# EasyEDA schematic SCH_prosthetic_2026-05-21.json
TITLE: Prosthetic Control Interface Board; REV: 1.0; Date: 2026-05-18; Sheet: 1/1; Drawn By: Tufan Layek; Company: SRMIST
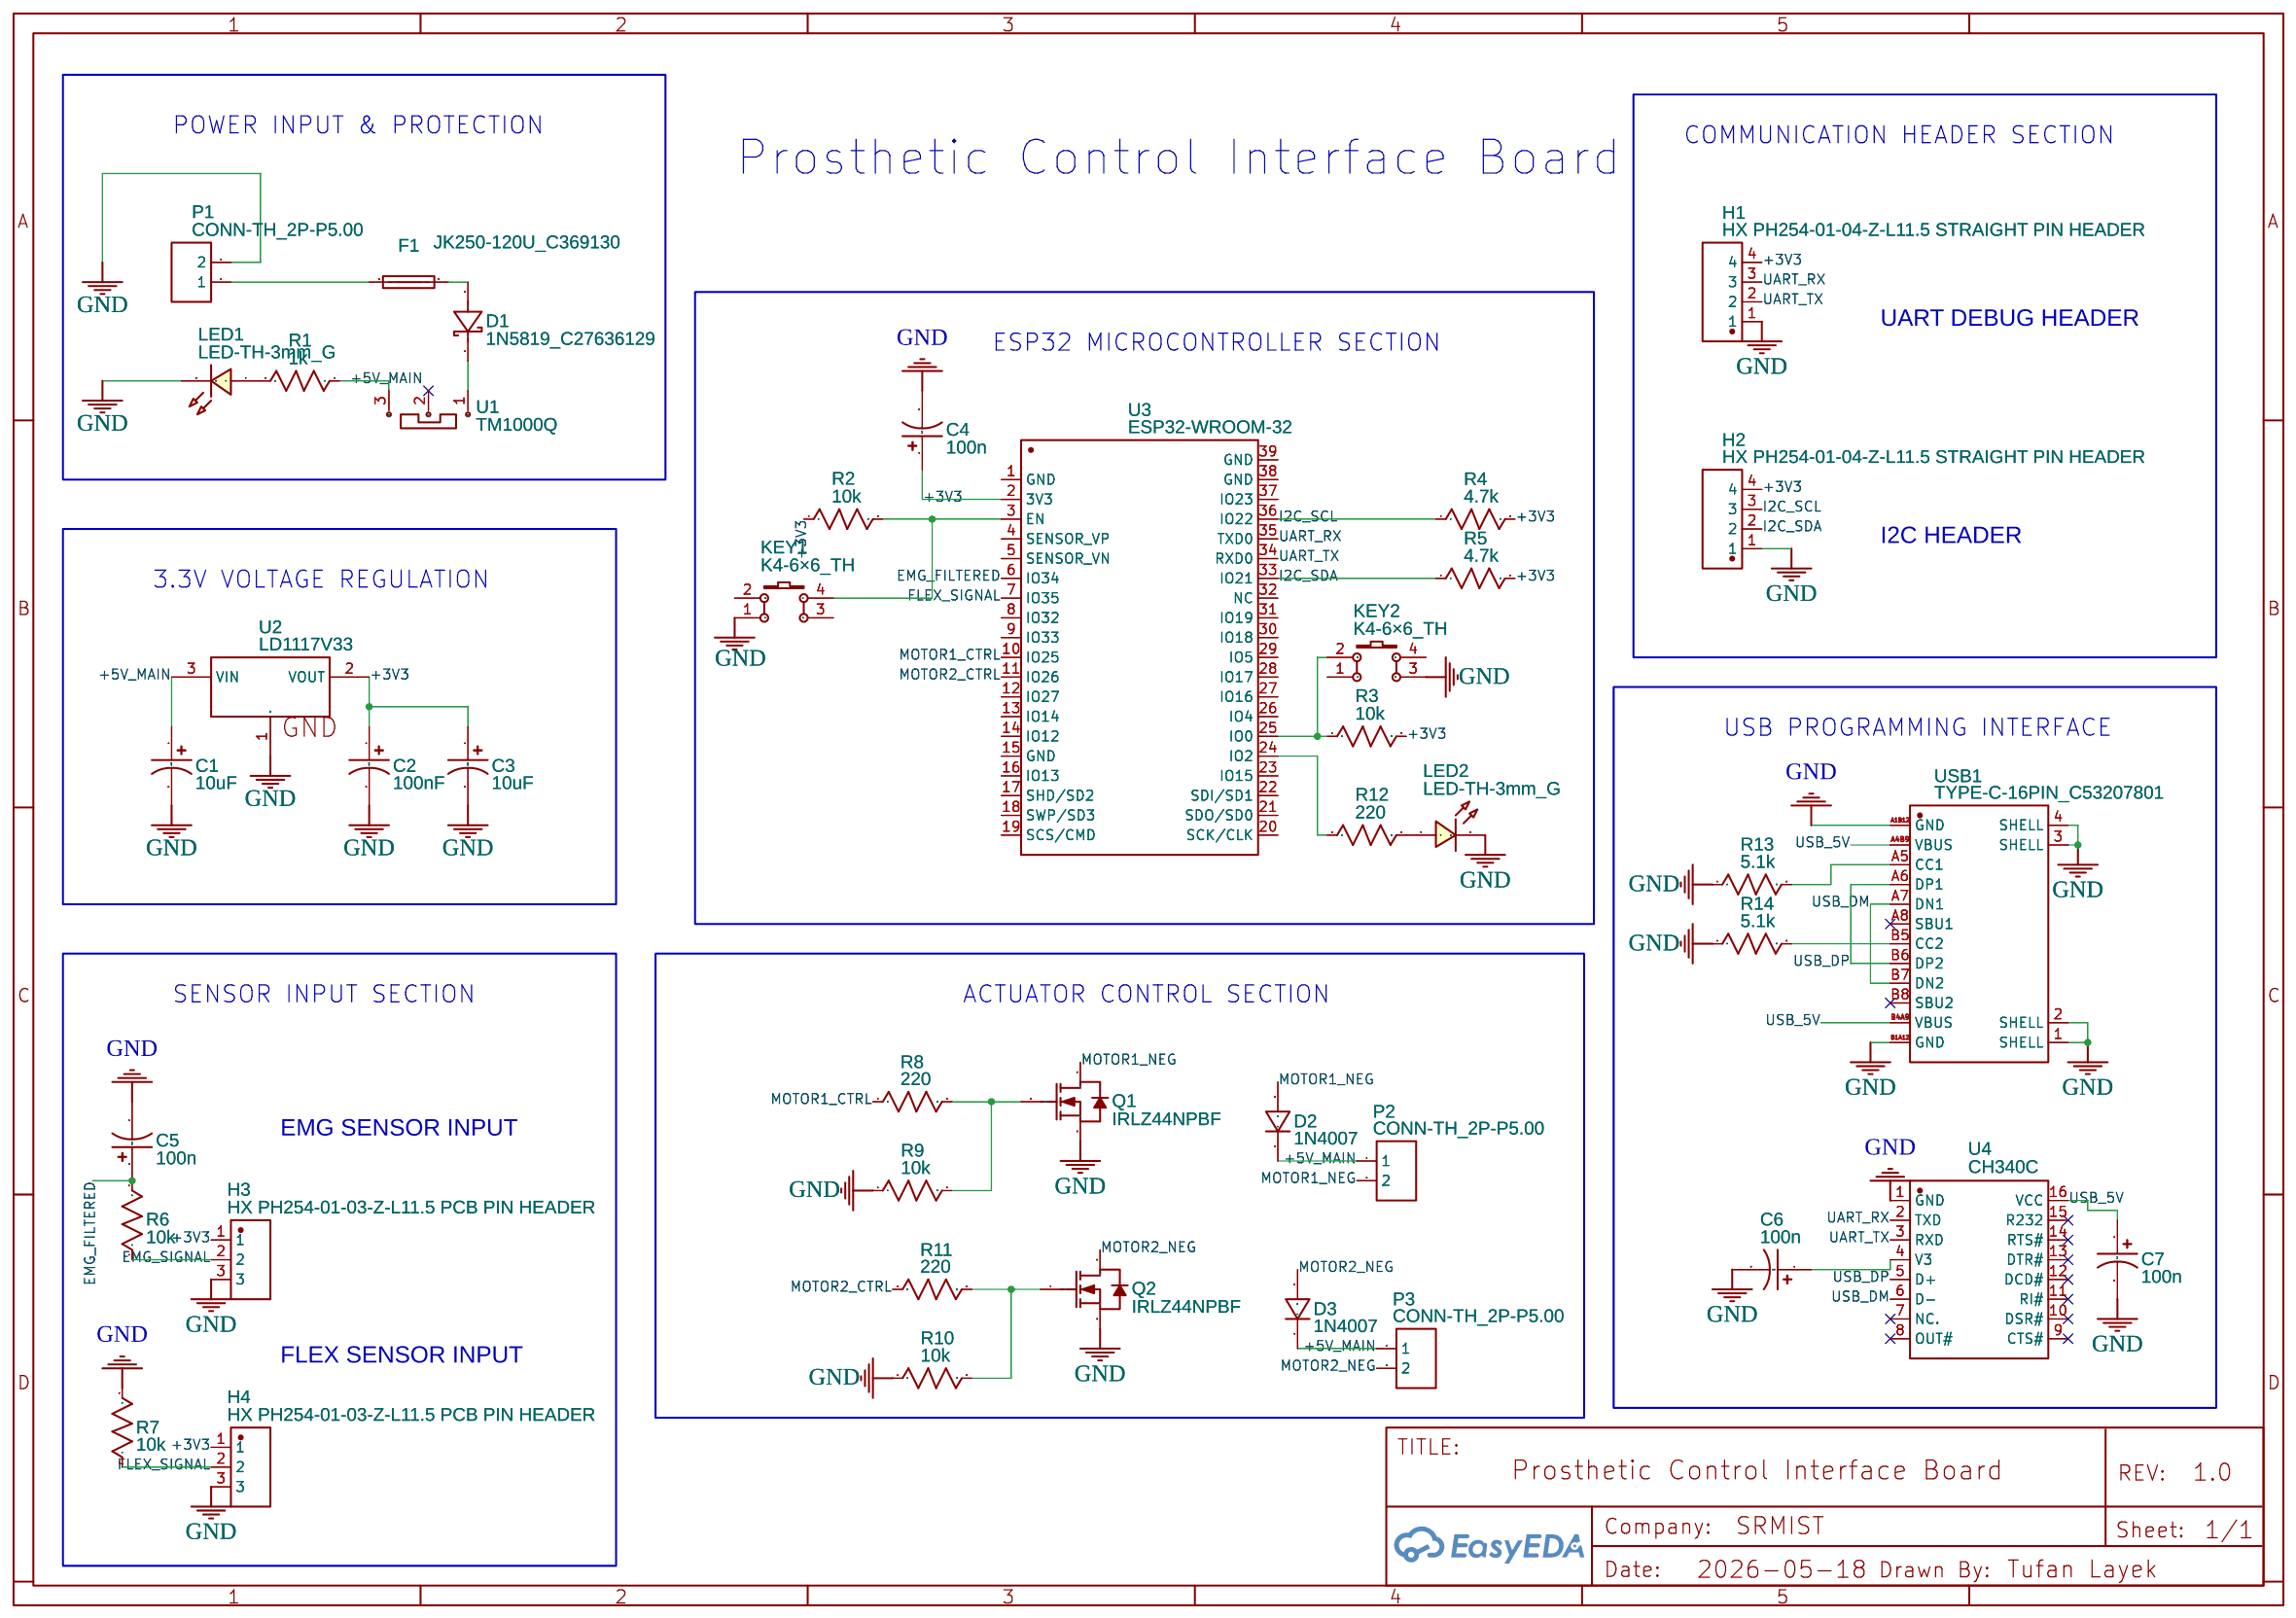
[diagram p0: schematic sheet]

## Parts
C1  10uF  [CAP-D4.0×F1.5]
C2  100nF  [CAP-D4.0×F1.5]
C3  10uF  [CAP-D4.0×F1.5]
C4  100n  [CAP-D4.0×F1.5]
C5  100n  [CAP-D4.0×F1.5]
C6  100n  [CAP-D4.0×F1.5]
C7  100n  [CAP-D4.0×F1.5]
D1  1N5819_C27636129  [DO-41_BD2.4-L4.7-P8.70-D0.9-RD]
D2  1N4007  [DO-41_BD2.4-L4.7-P8.70-D0.9-RD]
D3  1N4007  [DO-41_BD2.4-L4.7-P8.70-D0.9-RD]
F1  JK250-120U_C369130  [FUSE-TH_L7.0-W4.5-P5.10-D0.6]
H1  HX PH254-01-04-Z-L11.5 STRAIGHT PIN HEADER  [HDR-TH_4P-HX-PH254-01-04-Z-L11.5]
H2  HX PH254-01-04-Z-L11.5 STRAIGHT PIN HEADER  [HDR-TH_4P-HX-PH254-01-04-Z-L11.5]
H3  HX PH254-01-03-Z-L11.5 PCB PIN HEADER  [HDR-TH_3P-P2.54-V-M-1]
H4  HX PH254-01-03-Z-L11.5 PCB PIN HEADER  [HDR-TH_3P-P2.54-V-M-1]
KEY1  K4-6×6_TH  [KEY-TH_4P-L6.0-W6.0-P4.50-LS6.5]
KEY2  K4-6×6_TH  [KEY-TH_4P-L6.0-W6.0-P4.50-LS6.5]
LED1  LED-TH-3mm_G  [LED-TH_BD3.0_GREEN]
LED2  LED-TH-3mm_G  [LED-TH_BD3.0_GREEN]
P1  CONN-TH_2P-P5.00  [CONN-TH_2P-P5.00]
P2  CONN-TH_2P-P5.00  [CONN-TH_2P-P5.00]
P3  CONN-TH_2P-P5.00  [CONN-TH_2P-P5.00]
Q1  IRLZ44NPBF  [TO-220-3_L10.0-W4.5-P2.54-T]
Q2  IRLZ44NPBF  [TO-220-3_L10.0-W4.5-P2.54-T]
R1  1k  [R_AXIAL-0.3]
R2  10k  [R_AXIAL-0.3]
R3  10k  [R_AXIAL-0.3]
R4  4.7k  [R_AXIAL-0.3]
R5  4.7k  [R_AXIAL-0.3]
R6  10k  [R_AXIAL-0.3]
R7  10k  [R_AXIAL-0.3]
R8  220  [R_AXIAL-0.3]
R9  10k  [R_AXIAL-0.3]
R10  10k  [R_AXIAL-0.3]
R11  220  [R_AXIAL-0.3]
R12  220  [R_AXIAL-0.3]
R13  5.1k  [R_AXIAL-0.3]
R14  5.1k  [R_AXIAL-0.3]
U1  TM1000Q  [SENSORM-TH_3P-P2.15-L8.4-W6.5]
U2  LD1117V33  [TO-220-3_L10.0-W4.5-P2.54-L]
U3  ESP32-WROOM-32  [WIFIM-SMD_ESP32-WROOM-32-N4]
U4  CH340C  [SOP-16_L10.0-W3.9-P1.27-LS6.0-BL]
USB1  TYPE-C-16PIN_C53207801  [USB-C-SMD_TYPE-C16PIN-SHOUHAN]

## Library data of the parts
C1 C3 = CE_TH_D4.0×F1.5_US: Supplier Part: C46867109; Supplier: LCSC; Contributor: LCEDA_Lib; Manufacturer Part: 10UF50VC110GL; Manufacturer: Econd(米朗电子)
C2 = CE_TH_D4.0×F1.5_US: Supplier Part: C3011927; Supplier: LCSC; Contributor: LCEDA_Lib; Manufacturer Part: B220630V104J7ABLBY; Manufacturer: QIXING(七星)
C4-C7 = CE_TH_D4.0×F1.5_US: Supplier Part: C3029585; Supplier: LCSC; Contributor: LCEDA_Lib; Manufacturer Part: I104K44LEXLX; Manufacturer: CKX(錞谷)
D1 = 1N5819_C27636129: Supplier: LCSC; Supplier Part: C27636129; Manufacturer: DOWO(东沃); Manufacturer Part: 1N5819; JLCPCB Part Class: Extended Part; Contributor: lcsc
D2 D3 = 1N4007: Supplier: LCSC; Manufacturer: SEMTECH; Supplier Part: C106903; Contributor: LCEDA_Lib
F1 = JK250-120U_C369130: Contributor: LCSC; Supplier: LCSC; Supplier Part: C369130; Manufacturer: JK(金科); Manufacturer Part: JK250-120U; JLCPCB Part Class: Extended Part
H1 H2 = HX PH254-01-04-Z-L11.5 STRAIGHT PIN HEADER: Supplier: LCSC; Supplier Part: C52016392; Manufacturer: hanxia(韩下); Manufacturer Part: HX PH254-01-04-Z-L11.5 straight pin header; JLCPCB Part Class: Extended Part; Contributor: lcsc
H3 H4 = HX PH254-01-03-Z-L11.5 PCB PIN HEADER: Supplier: LCSC; Supplier Part: C52016391; Manufacturer: hanxia(韩下); Manufacturer Part: HX PH254-01-03-Z-L11.5 pcb pin header; JLCPCB Part Class: Extended Part; Contributor: lcsc
KEY1 KEY2 = K4-6×6_TH: Supplier: LCSC; Supplier Part: C136684; Manufacturer: 韩国韩荣; Manufacturer Part: K2-1102DP-E4SW-04; Contributor: LCEDA_Lib
LED1 LED2 = LED-TH-3mm_G: Manufacturer: EVERLIGHT(台湾亿光); Manufacturer Part: 204-10SYGD/S530-E3; Supplier Part: C85161; Contributor: LCEDA_Lib
P1-P3 = CONN-TH_2P-P5.00: Supplier Part: C7435875; Supplier: LCSC; Manufacturer: KEFA(科发); Manufacturer Part: KFM736D-5.0-2P; Contributor: LCEDA_Lib
Q1 Q2 = IRLZ44NPBF: Supplier: LCSC; Manufacturer: Infineon(英飞凌); Supplier Part: C38774; JLCPCB Part Class: Extended Part
R1-R3 R6 R7 R9 R10 = R_AXIAL-0.3_US: Supplier Part: C3547097; Supplier: LCSC; Contributor: LCEDA_Lib; Manufacturer Part: MFR-25FBF52-10K2; Manufacturer: YAGEO(国巨)
R4 R5 = R_AXIAL-0.3_US: Supplier Part: C3361916; Supplier: LCSC; Contributor: LCEDA_Lib; Manufacturer Part: OF472KE; Manufacturer: Ohmite
R8 R11 R12 = R_AXIAL-0.3_US: Supplier Part: C2896975; Supplier: LCSC; Contributor: LCEDA_Lib; Manufacturer Part: CR1/8W-220Ω±5%-ST52; Manufacturer: VO(翔胜)
R13 R14 = R_AXIAL-0.3_US: Supplier Part: C2897080; Supplier: LCSC; Contributor: LCEDA_Lib; Manufacturer Part: CR1/8W-5K1±5%-ST26; Manufacturer: VO(翔胜)
U1 = TM1000Q: Contributor: LCSC; Supplier: LCSC; Supplier Part: C273509; Manufacturer: E-Switch; JLCPCB Part Class: Extended Part
U2 = LD1117V33: Contributor: LCSC; Supplier: LCSC; Supplier Part: C283467; Manufacturer: ST(意法半导体); JLCPCB Part Class: Extended Part
U3 = ESP32-WROOM-32: Contributor: LCSC; Supplier: LCSC; Supplier Part: C82899; Manufacturer: ESPRESSIF(乐鑫); Manufacturer Part: ESP32-WROOM-32-N4; JLCPCB Part Class: Extended Part
U4 = CH340C: Supplier: LCSC; Manufacturer: WCH(南京沁恒); Supplier Part: C84681; JLCPCB Part Class: Extended Part
USB1 = TYPE-C-16PIN_C53207801: Supplier: LCSC; Supplier Part: C53207801; Manufacturer: JXTCONN(聚兴泰); Manufacturer Part: TYPE-C-16PIN; JLCPCB Part Class: Extended Part; Contributor: lcsc

## Nets
+3V3: C2.1 C3.1 C4.1 H1.4 H2.4 H3.1 H4.1 R2.1 R3.2 R4.2 R5.2 U2.2(VOUT) U3.2(3V3)
+5V_MAIN: C1.1 D2.1 D3.1 P2.1 P3.1 R1.1 U1.3(PIN3) U2.3(VIN)
GND: C1.2 C2.2 C3.2 C4.2 C5.2 C6.2 C7.2 H1.1 H2.1 H3.3 H4.3 KEY1.1 KEY2.3 LED1.2 LED2.2 P1.2 Q1.3(S) Q2.3(S) R7.2 R9.1 R10.1 R13.1 R14.1 U2.1(GND) U4.1(GND) USB1.1(SHELL) USB1.2(SHELL) USB1.3(SHELL) USB1.4(SHELL) USB1.A1B12(GND) USB1.B1A12(GND)
EMG_FILTERED: C5.1 R6.2 U3.6(IO34)
EMG_SIGNAL: H3.2 R6.1
FLEX_SIGNAL: H4.2 R7.1 U3.7(IO35)
I2C_SCL: H2.3 R4.1 U3.36(IO22)
I2C_SDA: H2.2 R5.1 U3.33(IO21)
MOTOR1_CTRL: R8.1 U3.10(IO25)
MOTOR1_NEG: D2.2 P2.2 Q1.2(D)
MOTOR2_CTRL: R11.1 U3.11(IO26)
MOTOR2_NEG: D3.2 P3.2 Q2.2(D)
UART_RX: H1.3 U3.35(TXD0) U4.2(TXD)
UART_TX: H1.2 U3.34(RXD0) U4.3(RXD)
USB_5V: C7.1 U4.16(VCC) USB1.A4B9(VBUS) USB1.B4A9(VBUS)
USB_DM: U4.6(D-) USB1.A7(DN1) USB1.B7(DN2)
USB_DP: U4.5(D+) USB1.A6(DP1) USB1.B6(DP2)
Net-(C6-1): C6.1 U4.4(V3)
Net-(D1-1): D1.1(C) U1.1(PIN1)
Net-(D1-2): D1.2(A) F1.2
Net-(F1-1): F1.1 P1.1
Net-(KEY1-4): KEY1.4 R2.2 U3.3(EN)
Net-(KEY2-2): KEY2.2 R3.1 U3.25(IO0)
Net-(LED1-1): LED1.1 R1.2
Net-(LED2-1): LED2.1 R12.2
Net-(Q1-1): Q1.1(G) R8.2 R9.2
Net-(Q2-1): Q2.1(G) R10.2 R11.2
Net-(R12-1): R12.1 U3.24(IO2)
Net-(R13-2): R13.2 USB1.A5(CC1)
Net-(R14-2): R14.2 USB1.B5(CC2)

Not connected (* = marked no-connect by the designer): KEY1 2 3; KEY2 1 4; U1 2(PIN2)*; U3 1(GND) 4(SENSOR_VP) 5(SENSOR_VN) 8(IO32) 9(IO33) 12(IO27) 13(IO14) 14(IO12) 15(GND) 16(IO13) 17(SHD/SD2) 18(SWP/SD3) 19(SCS/CMD) 20(SCK/CLK) 21(SDO/SD0) 22(SDI/SD1) 23(IO15) 26(IO4) 27(IO16) 28(IO17) 29(IO5) 30(IO18) 31(IO19) 32(NC) 37(IO23) 38(GND) 39(GND); U4 7(NC.)* 8(OUT#)* 9(CTS#)* 10(DSR#)* 11(RI#)* 12(DCD#)* 13(DTR#)* 14(RTS#)* 15(R232)*; USB1 A8(SBU1)* B8(SBU2)*

## Notes on the sheet
- POWER INPUT & PROTECTION
- Prosthetic Control Interface Board
- COMMUNICATION HEADER SECTION
- UART DEBUG HEADER
- ESP32 MICROCONTROLLER SECTION
- I2C HEADER
- 3.3V VOLTAGE REGULATION
- USB PROGRAMMING INTERFACE
- SENSOR INPUT SECTION
- ACTUATOR CONTROL SECTION
- EMG SENSOR INPUT
- FLEX SENSOR INPUT
